# Altium schematic sheet STM32_IO.SchDoc
size 374 x 182 mm; Origin: Eagle
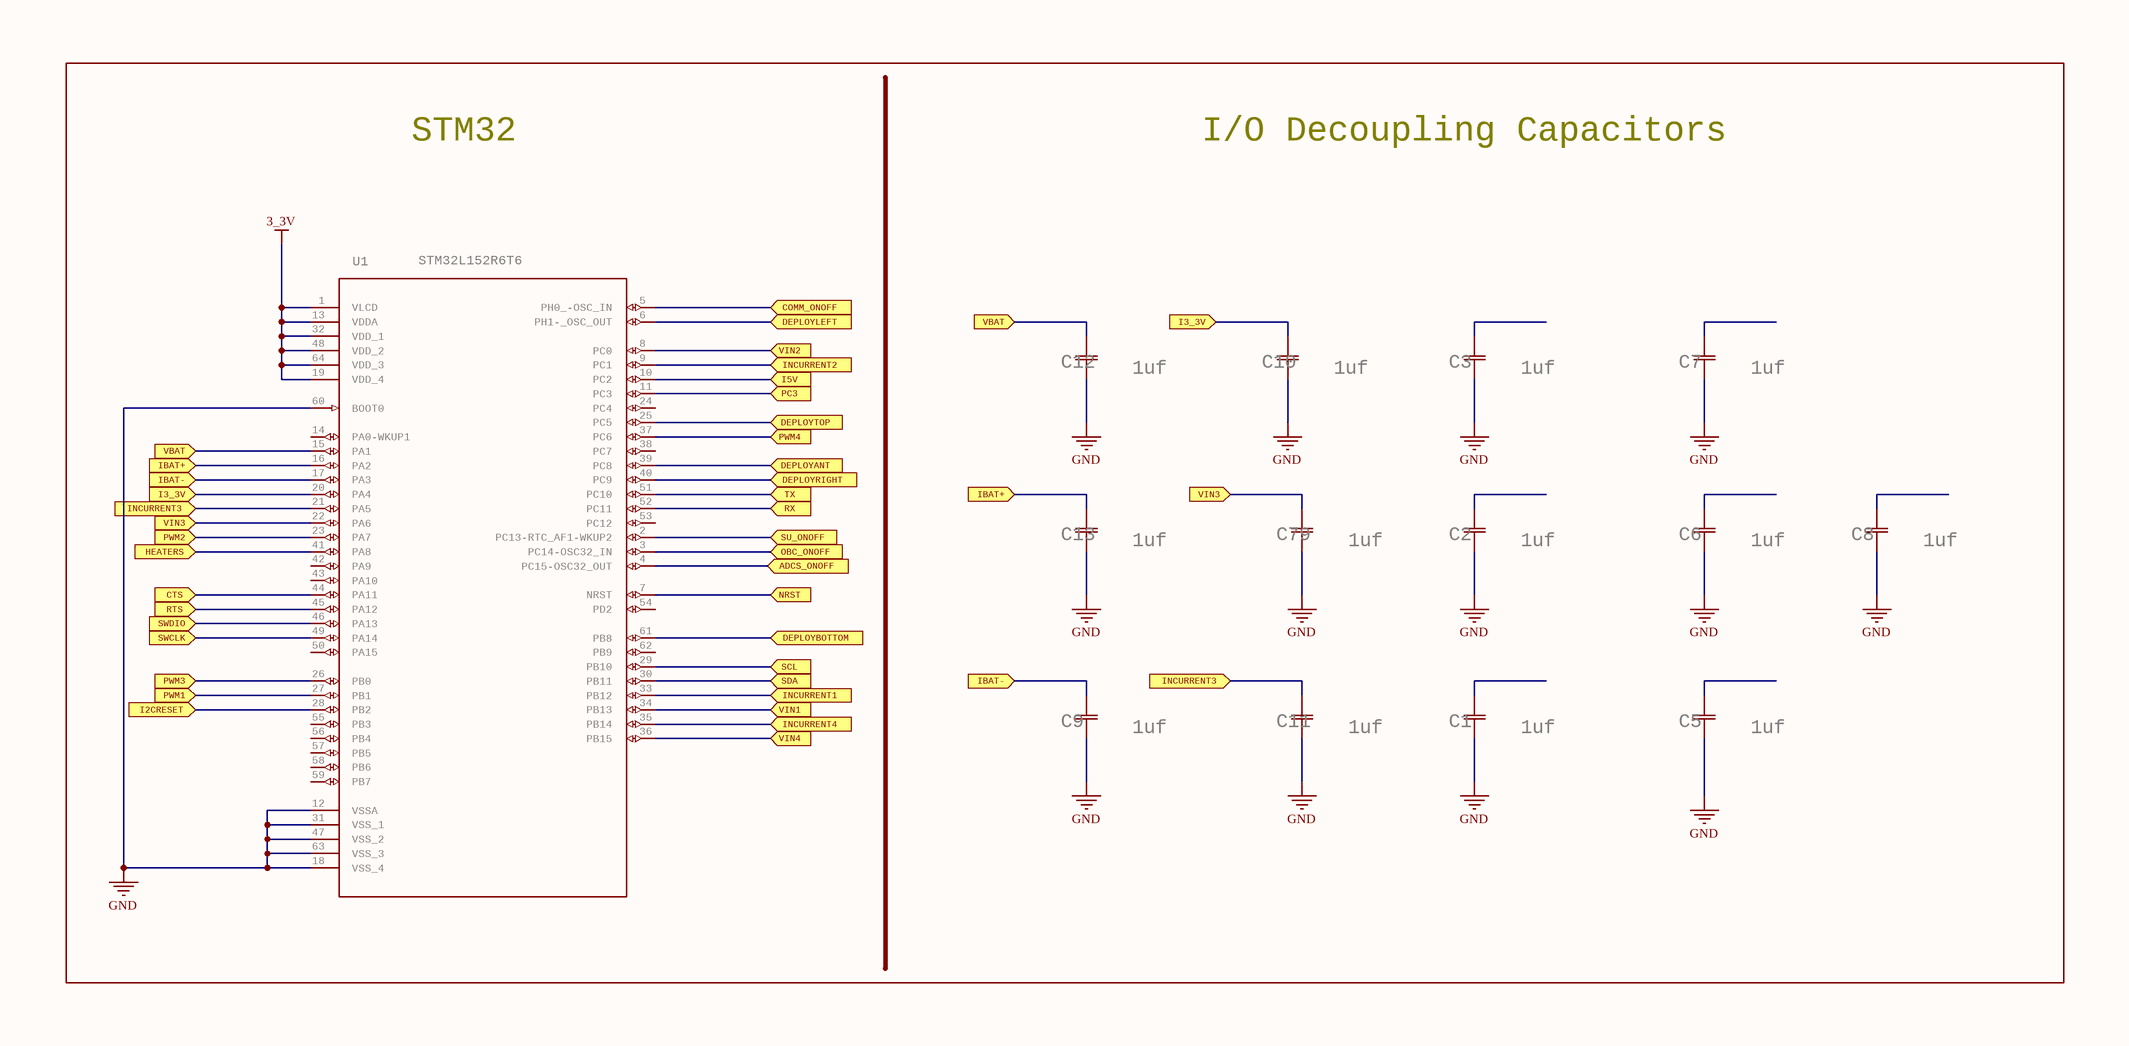
[diagram p0: STM32_IO.SchDoc]

## Parts
C1  1uf  [YAG_CC0603_YAG-L]
C2  1uf  [YAG_CC0603_YAG-L]
C3  1uf  [YAG_CC0603_YAG-L]
C5  1uf  [YAG_CC0603_YAG-L]
C6  1uf  [YAG_CC0603_YAG-L]
C7  1uf  [YAG_CC0603_YAG-L]
C8  1uf  [YAG_CC0603_YAG-L]
C9  1uf  [YAG_CC0603_YAG-L]
C10  1uf  [YAG_CC0603_YAG-L]
C11  1uf  [YAG_CC0603_YAG-L]
C12  1uf  [YAG_CC0603_YAG-L]
C13  1uf  [YAG_CC0603_YAG-L]
C79  1uf  [YAG_CC0603_YAG-L]
U1  STM32L152R6T6  [QFP50P1200X1200X160-64N]

## Ports
ADCS_ONOFF (in), COMM_ONOFF (in), CTS (in), DEPLOYANT (in), DEPLOYBOTTOM (in), DEPLOYLEFT (in), DEPLOYRIGHT (in), DEPLOYTOP (in), HEATERS (in), I2CRESET (in), I3_3V (in), I5V (in), IBAT+ (in), IBAT- (in), INCURRENT1 (in), INCURRENT2 (in), INCURRENT3 (in), INCURRENT4 (in), NRST (in), OBC_ONOFF (in), PC3 (in), PWM1 (in), PWM2 (in), PWM3 (in), PWM4 (in), RTS (in), RX (in), SCL (in), SDA (in), SU_ONOFF (in), SWCLK (in), SWDIO (in), TX (in), VBAT (in), VIN1 (in), VIN2 (in), VIN3 (in), VIN4 (in)

## Nets
3_3V: U1.1(VLCD) U1.13(VDDA) U1.19(VDD_4) U1.32(VDD_1) U1.48(VDD_2) U1.64(VDD_3)
GND: C1.1 C2.1 C3.1 C5.1 C6.1 C7.1 C8.1 C9.1 C10.1 C11.1 C12.1 C13.1 C79.1 U1.12(VSSA) U1.18(VSS_4) U1.31(VSS_1) U1.47(VSS_2) U1.60(BOOT0) U1.63(VSS_3)
ADCS_ONOFF: U1.4(PC15-OSC32_OUT) ; port ADCS_ONOFF
COMM_ONOFF: U1.5(PH0_-OSC_IN) ; port COMM_ONOFF
CTS: U1.44(PA11) ; port CTS
DEPLOYANT: U1.39(PC8) ; port DEPLOYANT
DEPLOYBOTTOM: U1.61(PB8) ; port DEPLOYBOTTOM
DEPLOYLEFT: U1.6(PH1-_OSC_OUT) ; port DEPLOYLEFT
DEPLOYRIGHT: U1.40(PC9) ; port DEPLOYRIGHT
DEPLOYTOP: U1.25(PC5) ; port DEPLOYTOP
HEATERS: U1.41(PA8) ; port HEATERS
I2CRESET: U1.28(PB2) ; port I2CRESET
I3_3V: C10.2 U1.20(PA4) ; port I3_3V
I5V: U1.10(PC2) ; port I5V
IBAT+: C13.2 U1.16(PA2) ; port IBAT+
IBAT-: C9.2 U1.17(PA3) ; port IBAT-
INCURRENT1: U1.33(PB12) ; port INCURRENT1
INCURRENT2: U1.9(PC1) ; port INCURRENT2
INCURRENT3: C11.2 U1.21(PA5) ; port INCURRENT3
INCURRENT4: U1.35(PB14) ; port INCURRENT4
NRST: U1.7(NRST) ; port NRST
OBC_ONOFF: U1.3(PC14-OSC32_IN) ; port OBC_ONOFF
PC3: U1.11(PC3) ; port PC3
PWM1: U1.27(PB1) ; port PWM1
PWM2: U1.23(PA7) ; port PWM2
PWM3: U1.26(PB0) ; port PWM3
PWM4: U1.37(PC6) ; port PWM4
RTS: U1.45(PA12) ; port RTS
RX: U1.52(PC11) ; port RX
SCL: U1.29(PB10) ; port SCL
SDA: U1.30(PB11) ; port SDA
SU_ONOFF: U1.2(PC13-RTC_AF1-WKUP2) ; port SU_ONOFF
SWCLK: U1.49(PA14) ; port SWCLK
SWDIO: U1.46(PA13) ; port SWDIO
TX: U1.51(PC10) ; port TX
VBAT: C12.2 U1.15(PA1) ; port VBAT
VIN1: U1.34(PB13) ; port VIN1
VIN2: U1.8(PC0) ; port VIN2
VIN3: C79.2 U1.22(PA6) ; port VIN3
VIN4: U1.36(PB15) ; port VIN4

Not connected (* = marked no-connect by the designer): C1 2; C2 2; C3 2; C5 2; C6 2; C7 2; C8 2; U1 14(PA0-WKUP1) 24(PC4) 38(PC7) 42(PA9) 43(PA10) 50(PA15) 53(PC12) 54(PD2) 55(PB3) 56(PB4) 57(PB5) 58(PB6) 59(PB7) 62(PB9)

## Notes on the sheet
- STM32
- I/O Decoupling Capacitors

## Library data of the parts
C1-C3 C5-C13 C79 = CC0603KRX7R7BB105YAG_CC0603_YAG-L: GateName_1: A; SymbolName_1: CAPH; BUILT_BY: EMA_UL_Team; SOURCELIBRARY: Yageo_2014-12-31; VENDOR: Yageo; DeviceName: YAG_CC0603_YAG-L; LibraryName: Cap 1uf; DeviceSetName: CC0603KRX7R7BB105; MANUFACTURER_PART_NUMBER: CC0603KRX7R7BB105
U1 = STM32L152R6T6: Ultralow power ARM-based 32-bit MCU  Check prices; GateName_1: A; MF: STMicroelectronics; SymbolName_1: STM32L152R6T6; LibraryName: STM32L152R6T6 replace; DeviceSetName: STM32L152R6T6; AVAILABILITY: Not in stock; MP: STM32L152R6T6; PACKAGE: LQFP-64 STMicroelectronics; PRICE: None